# Altium schematic sheet Sheet3 - Alimentations.SchDoc
size A4; DocumentNumber: 1; SheetNumber: 3
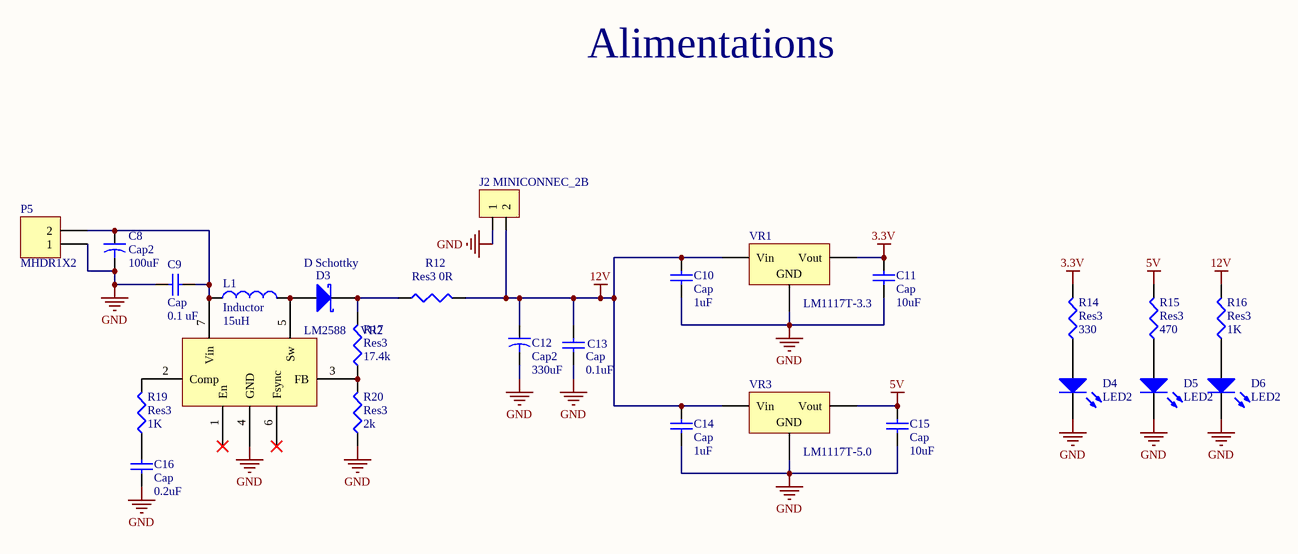
[diagram p0: Sheet3 - Alimentations.SchDoc]

## Parts
C8  Cap2  value 100uF  [CAPR5-4X5]
C9  Cap  value 0.1 uF  [RAD-0.3]
C10  Cap  value 1uF  [RAD-0.3]
C11  Cap  value 10uF  [RAD-0.3]
C12  Cap2  value 330uF  [CAPR5-4X5]
C13  Cap  value 0.1uF  [RAD-0.3]
C14  Cap  value 1uF  [RAD-0.3]
C15  Cap  value 10uF  [RAD-0.3]
C16  Cap  value 0.2uF  [RAD-0.3]
D3  D Schottky  [DSO-C2/X2.3]
D4  LED2  [DSO-F2/D6.1]
D5  LED2  [DSO-F2/D6.1]
D6  LED2  [DSO-F2/D6.1]
J2  MINICONNEC_2B  [MINICONNEC_C]
L1  Inductor  value 15uH  [INDC1005AL]
P5  MHDR1X2  [MHDR1X2]
R12  Res3  value 0R  [RESC1608L]
R14  Res3  value 330  [RESC1608L]
R15  Res3  value 470  [RESC1608L]
R16  Res3  value 1K  [RESC1608L]
R17  Res3  value 17.4k  [RESC1608L]
R19  Res3  value 1K  [RESC1608L]
R20  Res3  value 2k  [RESC1608L]
VR1  LM1117T-3.3  [TO254P1510-3_4N]
VR2  LM2588
VR3  LM1117T-5.0  [TO254P1510-3_4N]

## Nets
3.3V: C11.2 R14.2 VR1.3(Vout)
5V: C15.2 R15.2 VR3.3(Vout)
12V: C10.2 C12.1 C13.2 C14.2 J2.2 R12.2 R16.2 VR1.1(Vin) VR3.1(Vin)
GND: C8.2 C9.1 C10.1 C11.1 C12.2 C13.1 C14.1 C15.1 C16.1 D4.2(K) D5.2(K) D6.2(K) J2.1 P5.1 R20.1 VR1.2(GND) VR2.4(GND) VR3.2(GND)
NetC8_1: C8.1 C9.2 L1.1 P5.2 VR2.7(Vin)
NetC16_2: C16.2 R19.1
NetD3_1: D3.1(A) L1.2 VR2.5(Sw)
NetD3_2: D3.2(K) R12.1 R17.2
NetD4_1: D4.1(A) R14.1
NetD5_1: D5.1(A) R15.1
NetD6_1: D6.1(A) R16.1
NetR17_1: R17.1 R20.2 VR2.3(FB)
NetR19_2: R19.2 VR2.2(Comp)

Not connected (* = marked no-connect by the designer): VR2 1(En)* 6(Fsync)*

## Notes on the sheet
- Alimentations

## Library data of the parts
C8 C12 = Cap2: Capacitor; Published: 23-Sep-2002; PackageReference: CAPR5-4X5; Publisher: Altium Limited
C9-C11 C13-C16 = Cap: Capacitor; Published: 8-Jun-2000; LatestRevisionDate: 17-Jul-2002; LatestRevisionNote: Re-released for DXP Platform.; PackageReference: RAD-0.3; Publisher: Altium Limited
D3 = D Schottky: Schottky Diode; Published: 8-Jun-2000; LatestRevisionDate: 17-Jul-2002; LatestRevisionNote: Re-released for DXP Platform.; PackageReference: SMB; Publisher: Altium Limited; Code_JEDEC: DO-214-AA
D4-D6 = LED2: Typical RED, GREEN, YELLOW, AMBER GaAs LED; Published: 8-Jun-2000; LatestRevisionDate: 17-Jul-2002; LatestRevisionNote: Re-released for DXP Platform.; PackageVersion: Feb-2002; PackageReference: 3.2X1.6X1.1; Publisher: Altium Limited
J2 = MINICONNEC_2B: Connecteur
L1 = Inductor: Code_IEC: 1005; Published: 8-Jun-2000; LatestRevisionDate: 29-May-2009; LatestRevisionNote: IPC-7351 Footprint Added.; PackageReference: 0402-A; Publisher: Altium Limited; PackageDescription: Chip Inductor; Code_JEITA: 0402
P5 = MHDR1X2: Header, 2-Pin; LatestRevisionDate: 17-Jul-2002; LatestRevisionNote: Re-released for DXP Platform.; Publisher: Altium Limited
R12 R14-R17 R19 R20 = Res3: Resistor; Published: 8-Jun-2000; LatestRevisionDate: 29-May-2009; LatestRevisionNote: IPC-7351 Footprint Added.; PackageReference: J1-0603; Publisher: Altium Limited; PackageDescription: Chip Resistor
VR1 VR3 = Volt Reg: Voltage Regulator; Published: 24-Mar-1999; LatestRevisionDate: 29-May-2009; LatestRevisionNote: IPC-7351 Footprint Added.; PackageReference: D2PAK; Publisher: Altium Limited; PackageDescription: 3-Pin Transistor Outline Package 2.54 mm Pitch, 15.1 mm Lead Span